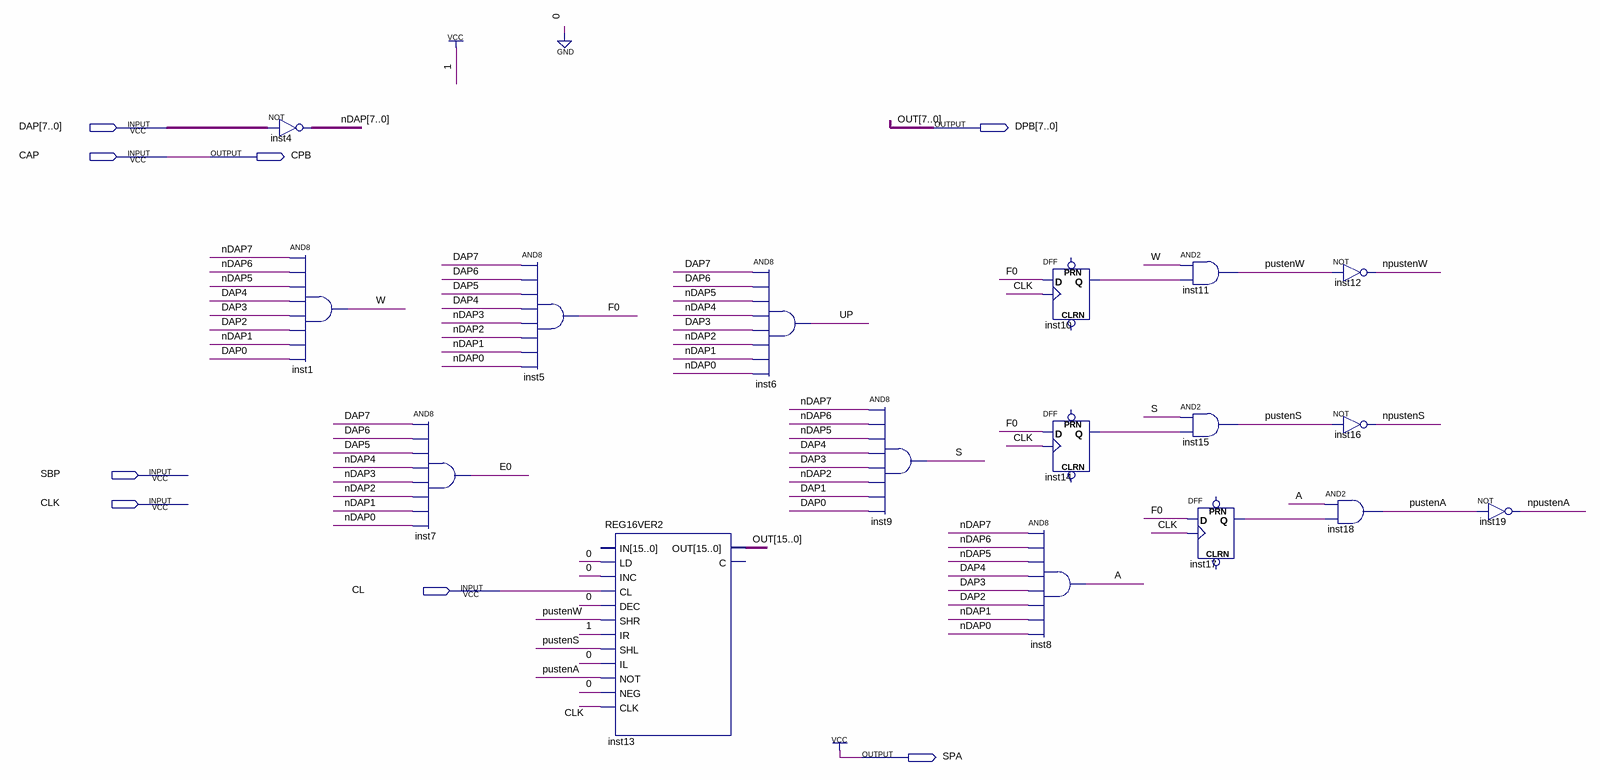
[diagram p0: schematic sheet]
// Quartus schematic P.bdf as structural Verilog: 17 symbols, 8 pins
module P (
  input  [7:0] DAP,
  input  CAP,
  input  SBP,
  input  CLK,
  input  CL,
  output [7:0] DPB,
  output CPB,
  output SPA
);

  wire A, E0, F0, inst10_q, inst14_q, inst17_q, npustenA, npustenS, npustenW, pustenA, pustenS, pustenW, S,
       UP, W;
  wire [7:0] nDAP;
  wire [15:8] OUT;

  assign nDAP = ~DAP;  // NOT inst4, 8 bits wide
  and inst1 (W, nDAP[7], nDAP[6], nDAP[5], DAP[4], DAP[3], DAP[2], nDAP[1], DAP[0]);
  and inst7 (E0, DAP[7], DAP[6], DAP[5], nDAP[4], nDAP[3], nDAP[2], nDAP[1], nDAP[0]);
  and inst5 (F0, DAP[7], DAP[6], DAP[5], DAP[4], nDAP[3], nDAP[2], nDAP[1], nDAP[0]);
  REG16VER2 inst13 (
    .LD(1'b0), .INC(1'b0), .CL(CL), .DEC(1'b0), .SHR(pustenW), .IR(1'b1), .SHL(pustenS), .IL(1'b0),
    .NOT(pustenA), .NEG(1'b0), .CLK(CLK), .OUT({OUT, DPB}));  // open: IN, C
  and inst6 (UP, DAP[7], DAP[6], nDAP[5], nDAP[4], DAP[3], nDAP[2], nDAP[1], nDAP[0]);
  and inst9 (S, nDAP[7], nDAP[6], nDAP[5], DAP[4], DAP[3], nDAP[2], DAP[1], DAP[0]);
  DFF inst10 (.CLK(CLK), .D(F0), .Q(inst10_q));  // open: CLRN, PRN
  DFF inst14 (.CLK(CLK), .D(F0), .Q(inst14_q));  // open: CLRN, PRN
  and inst8 (A, nDAP[7], nDAP[6], nDAP[5], DAP[4], DAP[3], DAP[2], nDAP[1], nDAP[0]);
  and inst11 (pustenW, W, inst10_q);
  and inst15 (pustenS, S, inst14_q);
  DFF inst17 (.CLK(CLK), .D(F0), .Q(inst17_q));  // open: CLRN, PRN
  not inst12 (npustenW, pustenW);
  not inst16 (npustenS, pustenS);
  and inst18 (pustenA, A, inst17_q);
  not inst19 (npustenA, pustenA);

  assign CPB = CAP;
  assign SPA = 1'b1;

  // Other names for the same wires on the sheet: OUT[7:0] = DPB
endmodule
